# EAGLE design schema (EAGLE 9.6.2)
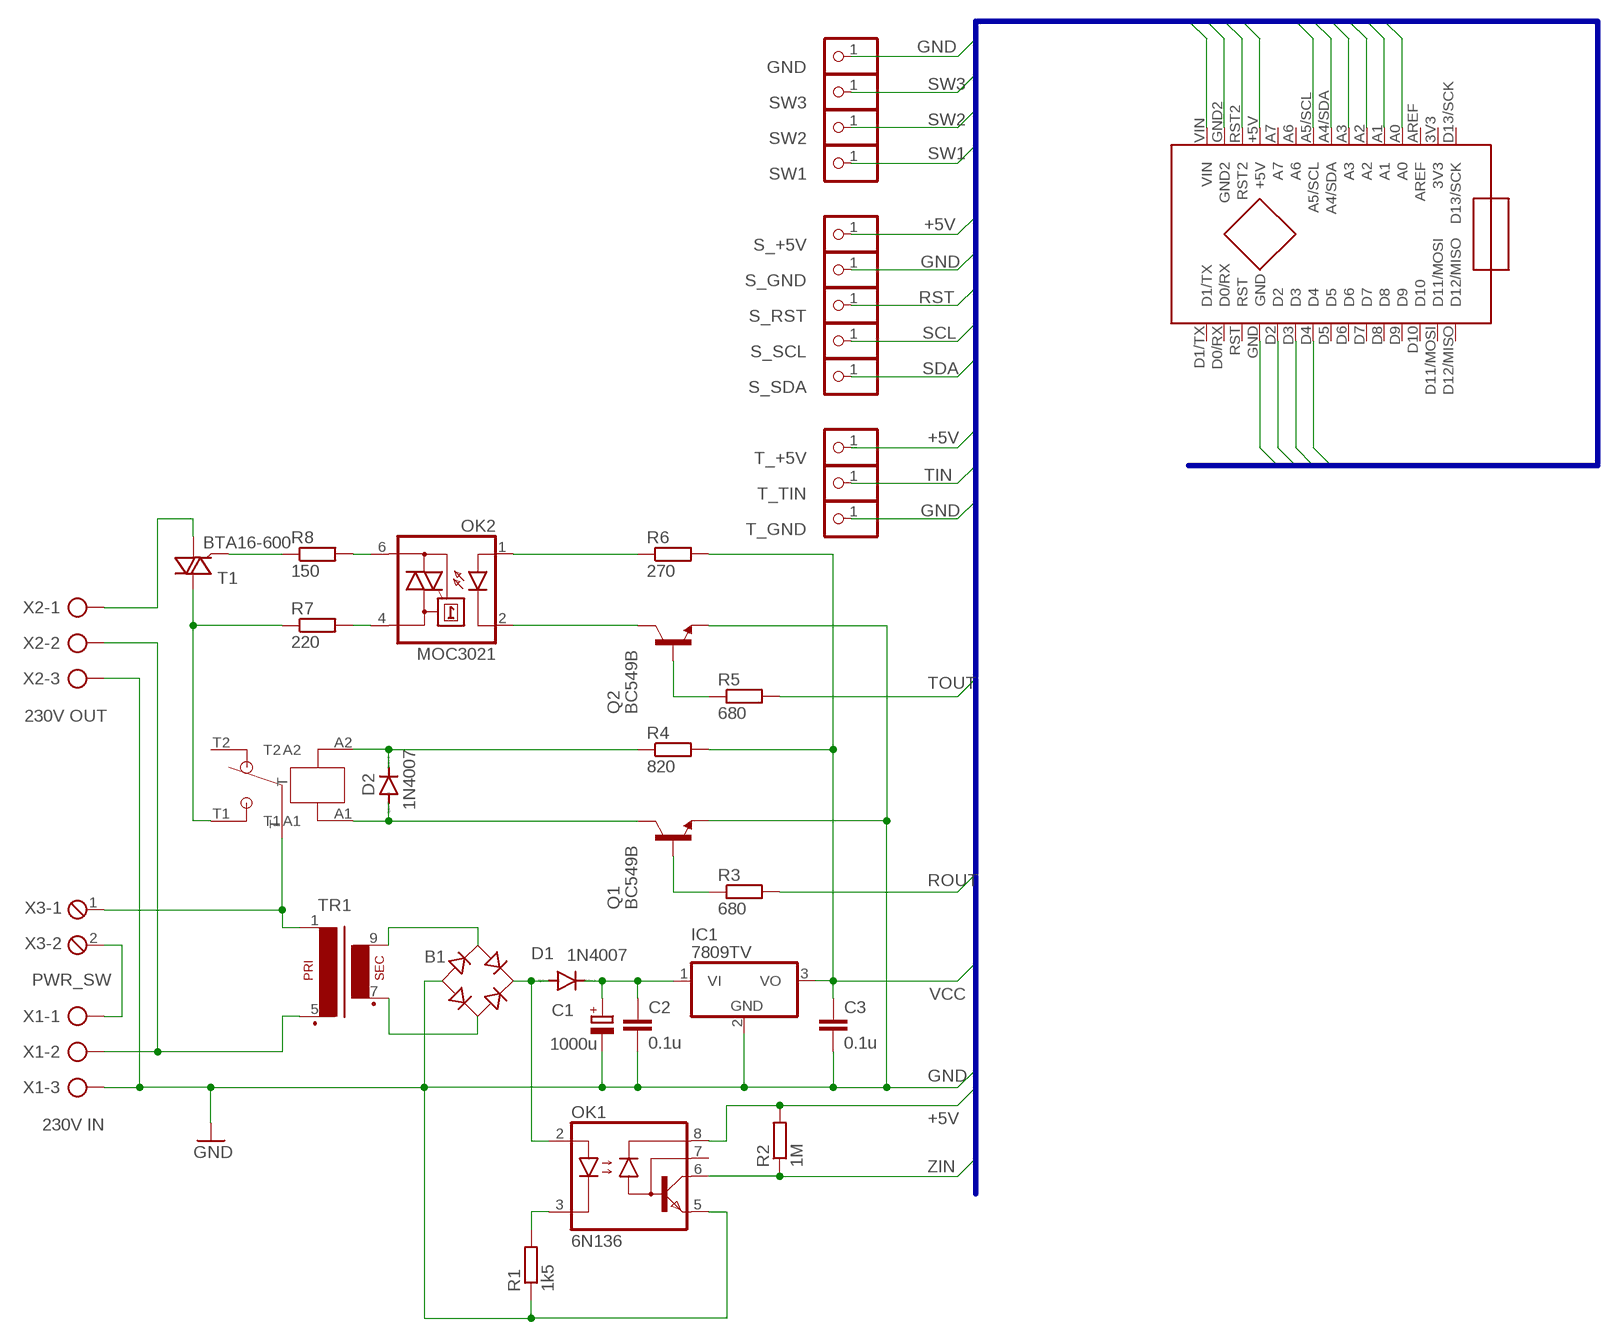
[diagram p0: schematic, sheet 1]

## Parts
B1  B-DIL  [B-DIL]
C1  1000u  CPOL-EUE5-8.5  [E5-8,5]
C2  0.1u  C-EU050-024X044  [C050-024X044]
C3  0.1u  C-EU050-024X044  [C050-024X044]
D1  1N4007  1N4148DO35-7  [DO35-7]
D2  1N4007  1N4148DO35-7  [DO35-7]
GND  PINHD-1X1  [1X01]
IC1  7809TV  7805TV  [TO220V]
OK1  6N136  6N135  [DIL08]
OK2  MOC3021  MOC3041M  [DIL06]
Q1  BC549B  [TO92-EBC]
Q2  BC549B  [TO92-EBC]
R1  1k5  R-EU_0204/2V  [0204V]
R2  1M  R-EU_0204/5  [0204/5]
R3  680  R-EU_0204/7  [0204/7]
R4  820  R-EU_0204/7  [0204/7]
R5  680  R-EU_0204/7  [0204/7]
R6  270  R-EU_0204/7  [0204/7]
R7  220  R-EU_0204/7  [0204/7]
R8  150  R-EU_0204/7  [0204/7]
S_+5V  PINHD-1X1  [1X01]
S_GND  PINHD-1X1  [1X01]
S_RST  PINHD-1X1  [1X01]
S_SCL  PINHD-1X1  [1X01]
S_SDA  PINHD-1X1  [1X01]
SW1  PINHD-1X1  [1X01]
SW2  PINHD-1X1  [1X01]
SW3  PINHD-1X1  [1X01]
T1  BTA16-600  BT138-V  [TO220BV]
T_+5V  PINHD-1X1  [1X01]
T_GND  PINHD-1X1  [1X01]
T_TIN  PINHD-1X1  [1X01]
TR1  EI30-1  [EI30-1]
U$1  FINDER_31.21.X  [FINDER_32.21.X]
U$2  ARDUINO_NANO  [ARDUINO_NANO]
X1  230V IN  AK500/3  [AK500/3]
X2  230V OUT  AK500/3  [AK500/3]
X3  PWR_SW  MPT2  [2POL254]

## Nets
+5V: OK1.8(VCC) R2.2 S_+5V.1 T_+5V.1 U$2.+5V
GND: B1.- C1.- C2.2 C3.2 GND.1 IC1.2(GND) OK1.5(GND) Q1.E Q2.E R1.1 S_GND.1 T_GND.1 U$2.GND U$2.GND2 X1.3 X2.3
N$1: X1.1 X3.2
N$2: TR1.1 U$1.T X3.1
N$3: TR1.5(P2) X1.2 X2.2
N$4: OK1.3(C) R1.2
N$5: B1.AC1 TR1.9(S4)
N$6: B1.AC2 TR1.7(S3)
N$7: B1.+ D1.A OK1.2(A)
N$8: C1.+ C2.1 D1.C IC1.1(VI)
N$12: R7.1 T1.T2(A2) U$1.T1
N$13: T1.T1(A1) X2.1
N$14: D2.A Q1.C U$1.A1
N$15: D2.C R4.1 U$1.A2
N$17: R8.1 T1.G
N$18: OK2.6(A2) R8.2
N$19: OK2.4(A1) R7.2
N$20: Q1.B R3.1
N$21: Q2.B R5.1
N$22: OK2.2(C) Q2.C
N$23: OK2.1(A) R6.1
ROUT: R3.2 U$2.A1
RST: S_RST.1 U$2.RST2
SCL: S_SCL.1 U$2.A5/SCL
SDA: S_SDA.1 U$2.A4/SDA
SW1: SW1.1 U$2.D2
SW2: SW2.1 U$2.D3
SW3: SW3.1 U$2.D4
TIN: T_TIN.1 U$2.A2
TOUT: R5.2 U$2.A0
VCC: C3.1 IC1.3(VO) R4.2 R6.2 U$2.VIN
ZIN: OK1.6(VO) R2.1 U$2.A3
Unconnected: OK1.7(VB) U$1.T2 U$2.3V3 U$2.A6 U$2.A7 U$2.AREF U$2.D0/RX U$2.D1/TX U$2.D5 U$2.D6 U$2.D7 U$2.D8 U$2.D9 U$2.D10 U$2.D11/MOSI U$2.D12/MISO U$2.D13/SCK U$2.RST

## Buses
+5V,GND,ROUT,RST,SCL,SDA,SW1,SW2,SW3,TIN,TOUT,VCC,ZIN

## Library data of the parts
B1 = rectifier:B-DIL: RECTIFIER
C1 = rcl:CPOL-EU: POLARIZED CAPACITOR, European symbol; SPICEPREFIX: C
C2 C3 = rcl:C-EU: CAPACITOR, European symbol; SPICEPREFIX: C
D1 D2 = diode:1N4148: DIODE high speed (Philips)
GND S_+5V S_GND S_RST S_SCL S_SDA SW1-SW3 T_+5V T_GND T_TIN = pinhead:PINHD-1X1: PIN HEADER
IC1 = linear:78*: Positive VOLTAGE REGULATOR Source: http://cache.national.com/ds/LM/LM78L05.pdf http://www.fairchildsemi.com/ds/LM/LM7805.pdf
OK1 = optocoupler:6N135: MOTOROLA OPTO COUPLER; MF: FAIRCHILD SEMICONDUCTOR; MPN: 6N135; OC_FARNELL: 1021342; OC_NEWARK: 58K9658
OK2 = optocoupler:MOC30*: 6-Pin DIP Zero-Cross Optoisolators Triac Driver Output (250/400 Volt Peak) Source: Data sheet <http://www.fairchildsemi.com/ds/MO/MOC3031M.pdf> The old path of data sheet not more available 2013-05-06.; MF: FAIRCHILD SEMICONDUCTOR; MPN: MOC3021; OC_FARNELL: 1086677; OC_NEWARK: 78K6090
Q1 Q2 = transistor-npn:BC549*: NPN Transistor
R1-R8 = rcl:R-EU_: RESISTOR, European symbol; SPICEPREFIX: R
T1 = triac:BT138: TRIAC Source: http://www.semiconductors.philips.com BT138_SERIES_2.pdf
TR1 = trafo:EI30-1: TRANSFORMER 1 primary winding, 1 secondary winding ERA
U$1 = perso:FINDER_31.21.X
U$2 = perso:ARDUINO_NANO
X1 X2 = con-ptr500:AK500/3: CONNECTOR; OC_FARNELL: unknown; OC_NEWARK: unknown
X3 = con-phoenix-254:MPT2: PHOENIX CONNECTOR; OC_FARNELL: unknown; OC_NEWARK: unknown

## Board
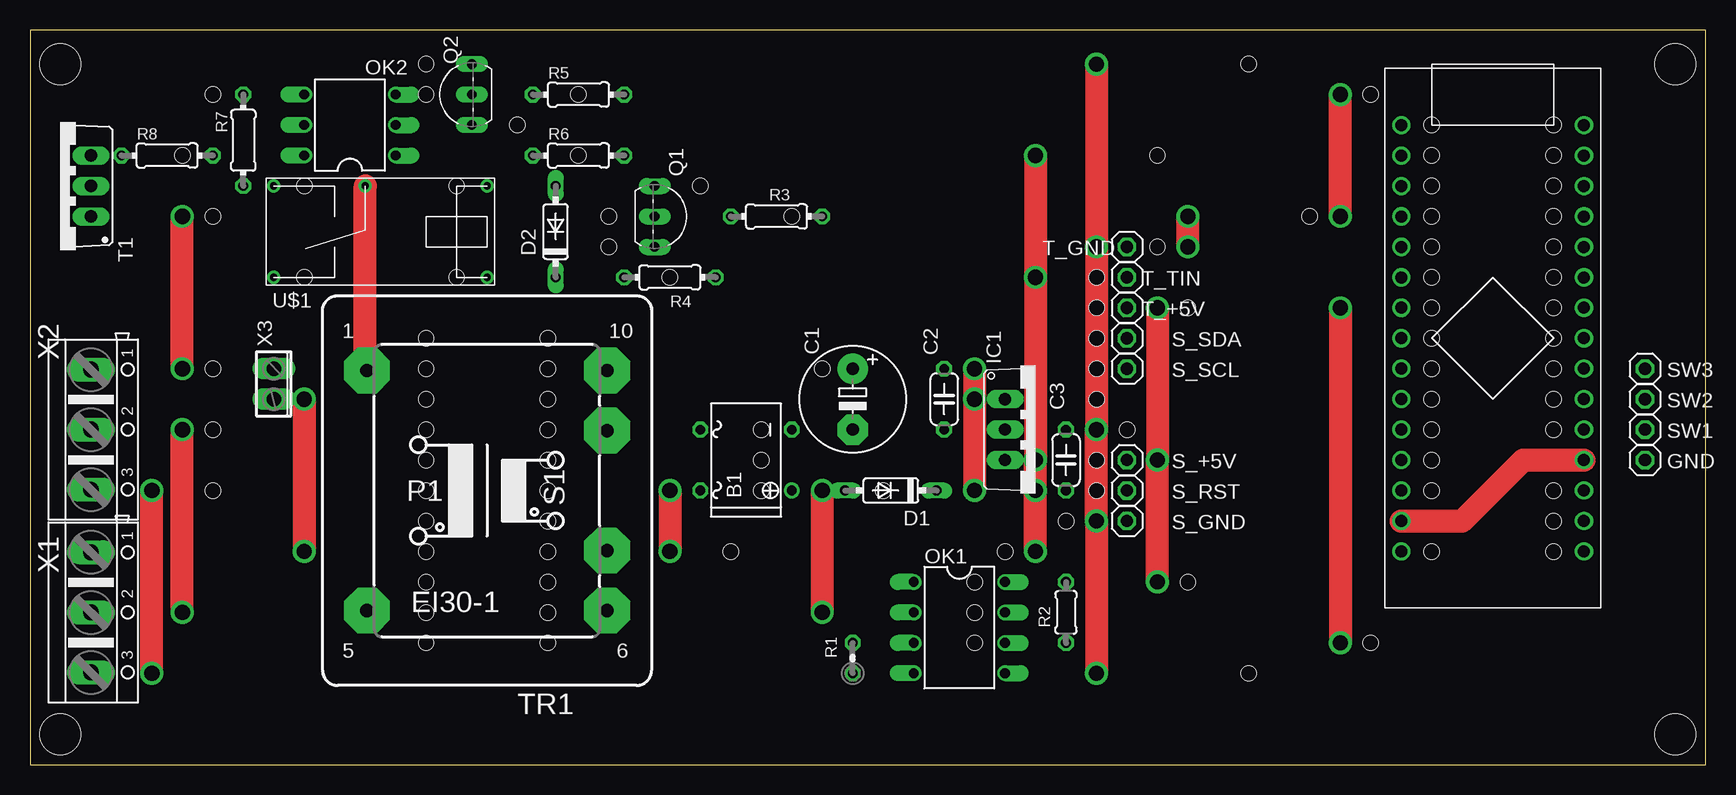
[diagram p1: board, top side]
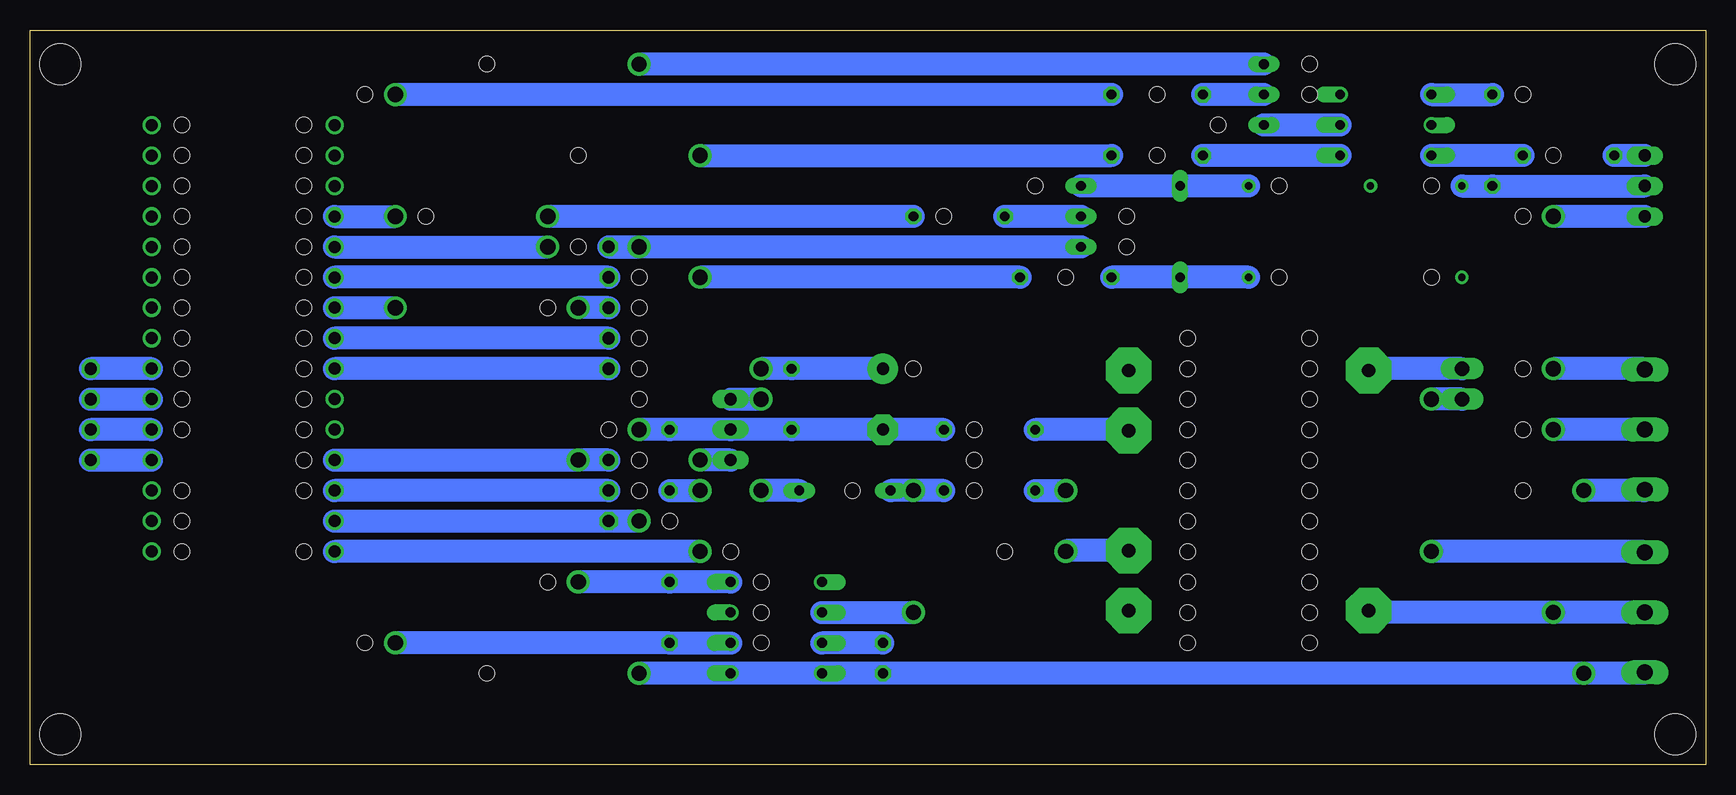
[diagram p2: board, bottom side, seen from below]

Size 139.68 x 61.26 mm. Coordinates in mm from the lower left corner, seen from the top.
Outline: 0,0 139.68,0 139.68,61.26 0,61.26 0,0
Copper layers (1*16): Top 0.035mm / dielectric 1.5mm / Bottom 0.035mm
Design rules "default": minimum track width 6mil, minimum drill 0.35mm, track to track 6mil, track to pad 6mil, pad to pad 6mil, via to via 6mil, smd to smd 6mil, copper to edge 40mil, drill to drill 6mil, minimum pad ring 10mil, minimum via ring 8mil, stop-mask expansion 4mil, vias tented up to drill 0mil, thermal gap 10mil
Holes 3.4 mm at 2.54,2.54 2.54,58.42 137.16,58.42 137.16,2.54
Holes 1.27 mm at 15.24,33.02 15.24,27.94 15.24,22.86 33.02,10.16 33.02,12.7 33.02,15.24 33.02,17.78 33.02,20.32 33.02,22.86 33.02,25.4 33.02,27.94 33.02,30.48 33.02,33.02 43.18,33.02 43.18,30.48 43.18,27.94 43.18,25.4 43.18,22.86 43.18,20.32 43.18,17.78 43.18,15.24 43.18,12.7 43.18,10.16 43.18,35.56 33.02,35.56 58.42,17.78 71.12,22.86 78.74,15.24 78.74,12.7 78.74,10.16 60.96,22.86 60.96,25.4 60.96,27.94 66.04,33.02 88.9,22.86 88.9,25.4 88.9,30.48 91.44,27.94 86.36,20.32 88.9,33.02 88.9,35.56 88.9,38.1 88.9,40.64 93.98,43.18 96.52,38.1 106.68,45.72 53.34,40.64 63.5,45.72 48.26,43.18 48.26,45.72 55.88,48.26 35.56,40.64 35.56,48.26 22.86,48.26 22.86,40.64 15.24,45.72 12.7,50.8 15.24,55.88 33.02,55.88 33.02,58.42 40.64,53.34 45.72,50.8 45.72,55.88 127,27.94 127,30.48 127,33.02 127,22.86 127,20.32 127,17.78 116.84,17.78 116.84,22.86 116.84,25.4 116.84,27.94 116.84,30.48 116.84,33.02 116.84,35.56 116.84,38.1 116.84,40.64 116.84,43.18 116.84,45.72 116.84,48.26 116.84,50.8 116.84,53.34 127,53.34 127,50.8 127,48.26 127,43.18 127,45.72 127,40.64 127,38.1 127,35.56 111.76,55.88 101.6,58.42 93.98,50.8 101.6,7.62 111.76,10.16 96.52,15.24 81.28,17.78

### Footprints (pad centres in the part's own frame; a part is rotated, then mirrored left to right if it is on the bottom)
B-DIL = drill 0.813: + -2.54,-3.81 | drill 0.813 octagon: - 2.54,-3.81; AC1 2.54,3.81; AC2 -2.54,3.81
E5-8,5 = drill 1.016 pad 2.54: + -2.54,0 | drill 1.016 pad 2.54 octagon: - 2.54,0
C050-024X044 = drill 0.813 octagon: 1 -2.54,0; 2 2.54,0
DO35-7 = drill 0.813 long: A 3.81,0; C -3.81,0
1X01 = drill 1.016 octagon: 1 0,0
TO220V = drill 1.016 long: 1 -2.54,-2.54; 2 0,-2.54; 3 2.54,-2.54
DIL08 = drill 0.813 offset: 1 -3.81,-3.81; 2 -1.27,-3.81; 3 1.27,-3.81; 4 3.81,-3.81; 5 3.81,3.81; 6 1.27,3.81; 7 -1.27,3.81; 8 -3.81,3.81
DIL06 = drill 0.813 offset: 1 -2.54,-3.81; 2 0,-3.81; 3 2.54,-3.81; 4 2.54,3.81; 5 0,3.81; 6 -2.54,3.81
TO92-EBC = drill 0.813 long: B 0,-1.27; C -2.54,-1.27; E 2.54,-1.27
0204V = drill 0.813 octagon: 1 -1.27,0; 2 1.27,0
0204/5 = drill 0.813 octagon: 1 -2.54,0; 2 2.54,0
0204/7 = drill 0.813 octagon: 1 -3.81,0; 2 3.81,0
TO220BV = drill 1.016 long: G 2.54,-2.54; T1 -2.54,-2.54; T2 0,-2.54
EI30-1 = drill 1.118 pad 3.81 octagon: 1 -10.008,10.008; 5 -10.008,-10.008; 6 10.008,-10.008; 7 10.008,-5.004; 9 10.008,5.004; 10 10.008,10.008
FINDER_32.21.X = drill 0.6: A1 -8.89,-3.81; A2 -8.89,3.81; T 1.27,-3.81; T1 8.89,-3.81; T2 8.89,3.81
ARDUINO_NANO = drill 1: 3V3 15.24,7.62; +5V -10.16,7.62; A0 10.16,7.62; A1 7.62,7.62; A2 5.08,7.62; A3 2.54,7.62; A4/SDA 0,7.62; A5/SCL -2.54,7.62; A6 -5.08,7.62; A7 -7.62,7.62; AREF 12.7,7.62; D0/RX -15.24,-7.62; D1/TX -17.78,-7.62; D2 -7.62,-7.62; D3 -5.08,-7.62; D4 -2.54,-7.62; D5 0,-7.62; D6 2.54,-7.62; D7 5.08,-7.62; D8 7.62,-7.62; D9 10.16,-7.62; D10 12.7,-7.62; D11/MOSI 15.24,-7.62; D12/MISO 17.78,-7.62; D13/SCK 17.78,7.62; GND -10.16,-7.62; GND2 -15.24,7.62; RST -12.7,-7.62; RST2 -12.7,7.62; VIN -17.78,7.62
AK500/3 = drill 1.321 long: 1 -5.004,0; 2 0,0; 3 5.004,0
2POL254 = drill 1.2 long: 1 -1.27,0; 2 1.27,0

### Placement (x,y rotation side)
B1  59.69,25.4 90 top
C1  68.58,30.48 270 top
C2  76.2,30.48 270 top
C3  86.36,25.4 90 top
D1  71.75,22.86 180 top
D2  43.81,44.45 90 top
GND  134.62,25.4 0 top
IC1  83.82,27.94 270 top
OK1  77.47,11.43 270 top
OK2  26.67,53.34 90 top
Q1  53.34,45.72 270 top
Q2  35.56,55.88 90 top
R1  68.58,8.89 90 top
R2  86.36,12.7 90 top
R3  62.23,45.72 0 top
R4  53.34,40.64 0 top
R5  45.72,55.88 0 top
R6  45.72,50.8 0 top
R7  17.78,52.07 90 top
R8  11.43,50.8 0 top
S_+5V  91.44,25.4 0 top
S_GND  91.44,20.32 0 top
S_RST  91.44,22.86 0 top
S_SCL  91.44,33.02 0 top
S_SDA  91.44,35.56 0 top
SW1  134.62,27.94 0 top
SW2  134.62,30.48 0 top
SW3  134.62,33.02 0 top
T1  2.54,48.26 90 top
T_+5V  91.44,38.1 0 top
T_GND  91.44,43.18 0 top
T_TIN  91.44,40.64 0 top
TR1  38.1,22.86 0 top
U$1  29.21,44.45 180 top
U$2  121.92,35.56 90 top
X1  5.08,12.7 270 top
X2  5.08,27.94 270 top
X3  20.32,31.75 270 top

### Tracks (layer width: path | path; a pad name or v marks a point on that pad's centre or on a via)
+5V  (via drill 1.27)
  Top 1.905: v93.98,15.24 v93.98,25.4 v93.98,38.1
  Bottom 1.905: U$2.+5V v93.98,25.4 S_+5V.1 | OK1.8 R2.2 v93.98,15.24 | T_+5V.1 v93.98,38.1
GND  (via drill 1.27)
  Top 1.905: v10.16,7.62 v10.16,22.86 | v88.9,7.62 v88.9,20.32 v88.9,27.94 v88.9,43.18 v88.9,58.42 | U$2.GND2 119.38,20.32 124.46,25.4 U$2.GND
  Bottom 1.905: B1.- C1.- C2.2 IC1.2 C3.2 v88.9,27.94 | X2.3 5.16,22.86 v10.16,22.86 | X1.3 5.16,7.62 v10.16,7.62 R1.1 OK1.5 v88.9,7.62 | Q1.E T_GND.1 v88.9,43.18 | Q2.E v88.9,58.42 | U$2.GND2 S_GND.1 v88.9,20.32 | GND.1 U$2.GND
N$1  (via drill 1.27)
  Top 1.905: v22.86,30.48 v22.86,17.78
  Bottom 1.905: X1.1 5.16,17.78 v22.86,17.78 | X3.2 v22.86,30.48
N$2
  Top 1.905: TR1.1 27.94,33.02 U$1.T
  Bottom 1.905: X3.1 27.94,33.02 TR1.1
N$3  (via drill 1.27)
  Top 1.905: v12.7,12.7 v12.7,27.94
  Bottom 1.905: X1.2 v12.7,12.7 27.94,12.7 TR1.5 | X2.2 v12.7,27.94
N$4
  Bottom 1.905: R1.2 OK1.3
N$5
  Bottom 1.905: TR1.9 48.18,27.94 B1.AC1
N$6  (via drill 1.27)
  Top 1.905: v53.34,22.86 v53.34,17.78
  Bottom 1.905: TR1.7 53.26,17.86 v53.34,17.78 | B1.AC2 v53.34,22.86
N$7  (via drill 1.27)
  Top 1.905: v66.04,22.86 v66.04,12.7
  Bottom 1.905: B1.+ v66.04,22.86 D1.A | OK1.2 v66.04,12.7
N$8  (via drill 1.27)
  Top 1.905: v78.74,22.86 v78.74,30.48 v78.74,33.02
  Bottom 1.905: C1.+ C2.1 v78.74,33.02 | IC1.1 v78.74,30.48 | D1.C v78.74,22.86
N$12
  Bottom 1.905: U$1.T1 R7.1 T1.T2
N$13  (via drill 1.27)
  Top 1.905: v12.7,33.02 v12.7,45.72
  Bottom 1.905: X2.1 5.16,33.02 v12.7,33.02 | T1.T1 v12.7,45.72
N$14
  Bottom 1.905: U$1.A1 D2.A Q1.C
N$15
  Bottom 1.905: U$1.A2 D2.C R4.1
N$17
  Bottom 1.905: T1.G R8.1
N$18
  Bottom 1.905: R8.2 OK2.6
N$19
  Bottom 1.905: OK2.4 R7.2
N$20
  Bottom 1.905: Q1.B R3.1
N$21
  Bottom 1.905: Q2.B R5.1
N$22
  Bottom 1.905: OK2.2 Q2.C
N$23
  Bottom 1.905: OK2.1 R6.1
ROUT  (via drill 1.27)
  Top 1.905: v96.52,43.18 v96.52,45.72
  Bottom 1.905: R3.2 v96.52,45.72 | U$2.A1 v96.52,43.18
RST
  Bottom 1.905: S_RST.1 U$2.RST2
SCL
  Bottom 1.905: S_SCL.1 U$2.A5/SCL
SDA
  Bottom 1.905: S_SDA.1 U$2.A4/SDA
SW1
  Bottom 1.905: U$2.D2 SW1.1
SW2
  Bottom 1.905: SW2.1 U$2.D3
SW3
  Bottom 1.905: U$2.D4 SW3.1
TIN
  Bottom 1.905: T_TIN.1 U$2.A2
TOUT  (via drill 1.27)
  Top 1.905: v109.22,45.72 v109.22,55.88
  Bottom 1.905: U$2.A0 v109.22,45.72 | R5.2 v109.22,55.88
VCC  (via drill 1.27)
  Top 1.905: v83.82,17.78 v83.82,22.86 v83.82,25.4 v83.82,40.64 v83.82,50.8
  Bottom 1.905: IC1.3 v83.82,25.4 | C3.1 v83.82,22.86 | R4.2 v83.82,40.64 | v83.82,50.8 R6.2 | v83.82,17.78 U$2.VIN
ZIN  (via drill 1.27)
  Top 1.905: v109.22,38.1 v109.22,10.16
  Bottom 1.905: OK1.6 R2.1 v109.22,10.16 | U$2.A3 v109.22,38.1